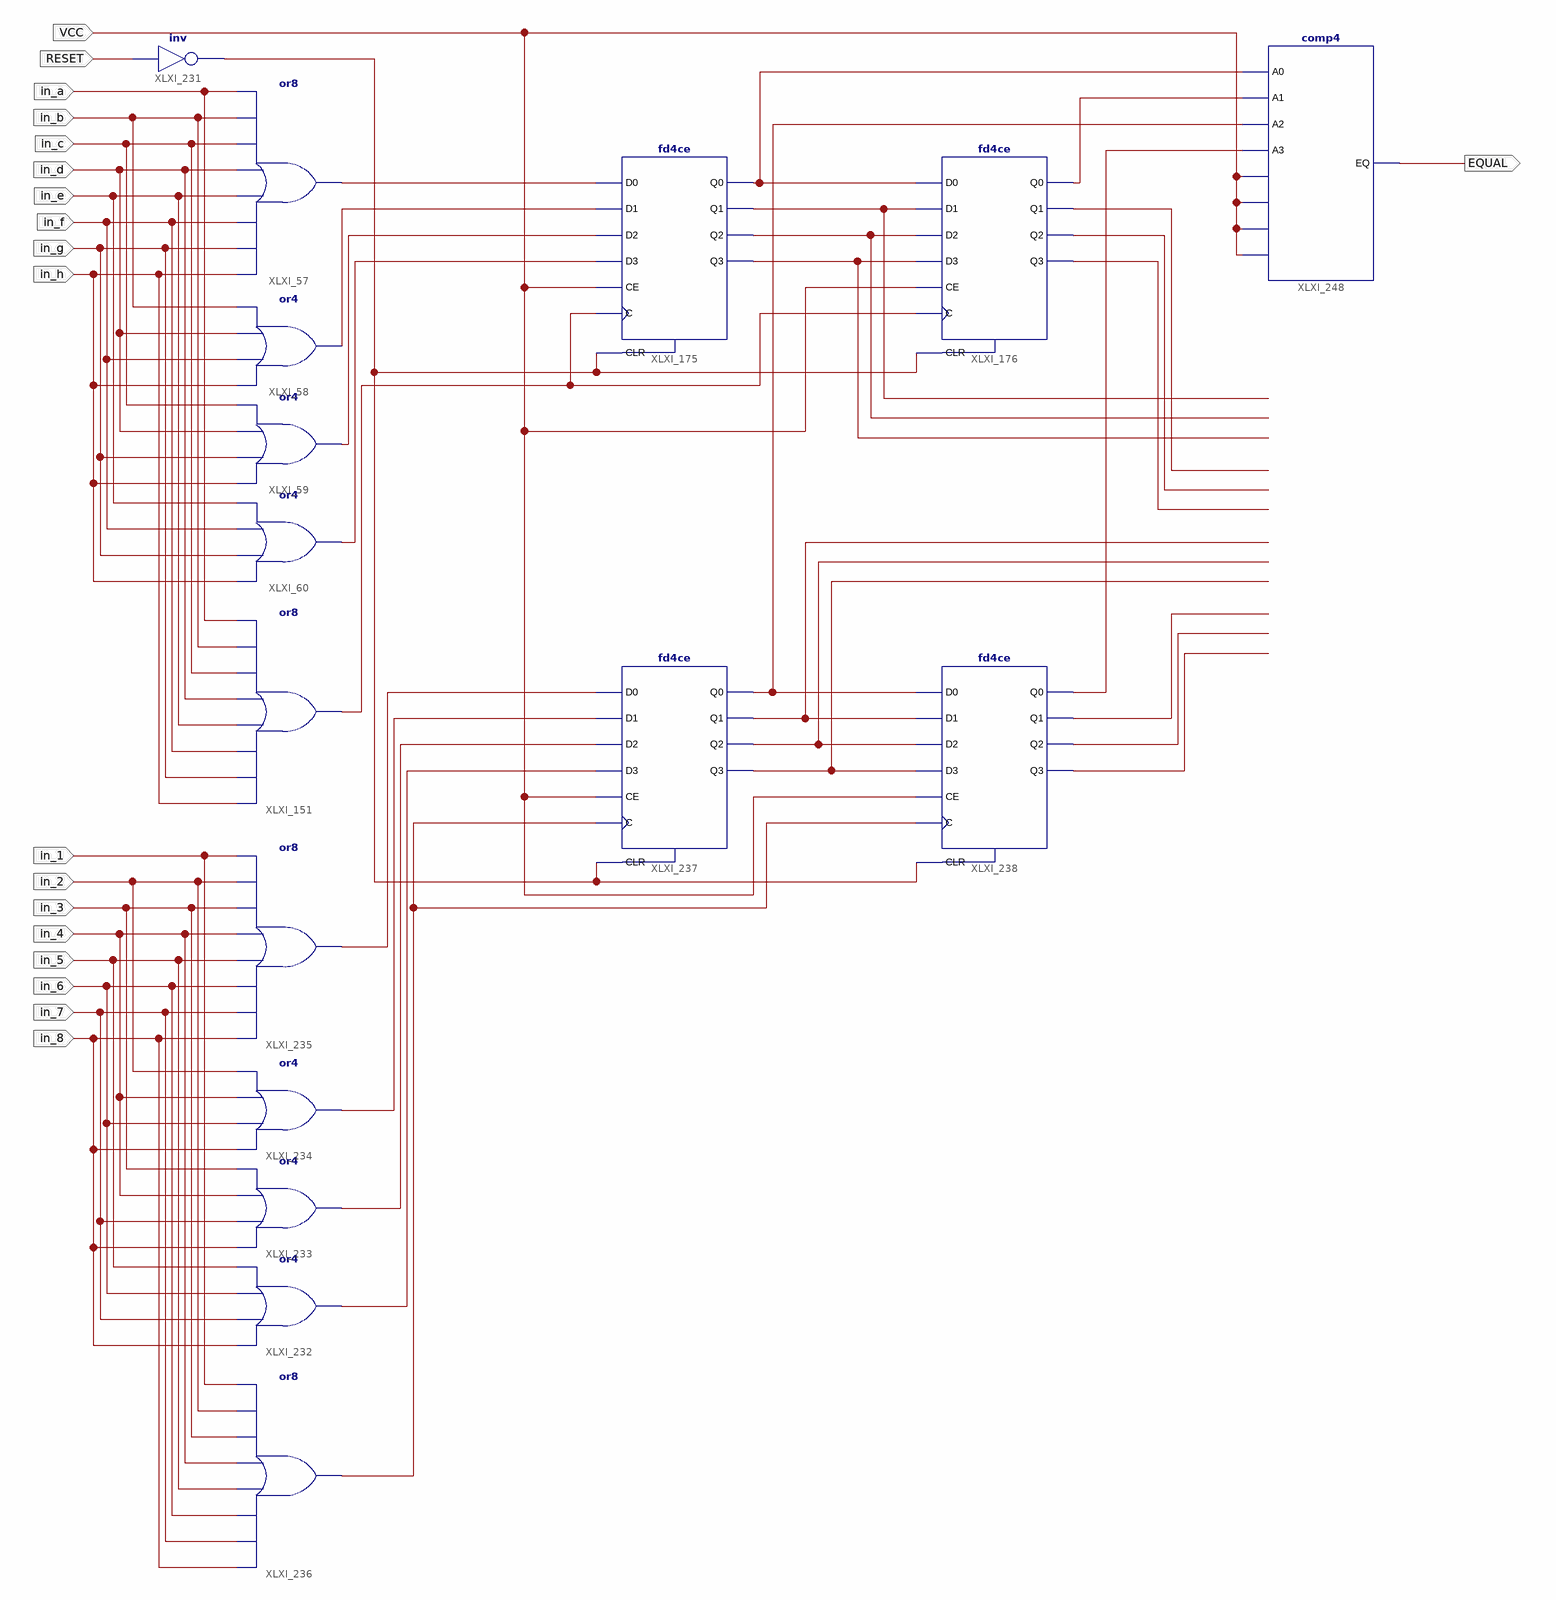
[diagram p0: schematic sheet 1]
// Xilinx ISE schematic switch_input.sch (spartan6) as structural Verilog: 16 symbols, 19 ports
module switch_input (
  input  in_a,
  input  in_g,
  input  in_h,
  input  in_f,
  input  in_e,
  input  in_d,
  input  in_c,
  input  in_b,
  input  RESET,
  input  in_1,
  input  in_7,
  input  in_8,
  input  in_6,
  input  in_5,
  input  in_4,
  input  in_3,
  input  in_2,
  input  VCC,
  output EQUAL
);

  wire comp_1, comp_2, comp_3, comp_4, XLXN_352, XLXN_353, XLXN_354, XLXN_355, XLXN_360, XLXN_511, XLXN_519,
       XLXN_521, XLXN_522, XLXN_523, XLXN_526, XLXN_539, XLXN_540, XLXN_542, XLXN_543, XLXN_544, XLXN_545,
       XLXN_546, XLXN_547, XLXN_548, XLXN_550, XLXN_552, XLXN_554;

  or XLXI_60 (XLXN_355, in_h, in_g, in_f, in_e);
  or XLXI_59 (XLXN_354, in_h, in_g, in_d, in_c);
  or XLXI_58 (XLXN_353, in_h, in_f, in_d, in_b);
  or XLXI_57 (XLXN_352, in_h, in_g, in_f, in_e, in_d, in_c, in_b, in_a);
  or XLXI_151 (XLXN_360, in_h, in_g, in_f, in_e, in_d, in_c, in_b, in_a);
  fd4ce XLXI_175 (
    .C(XLXN_360), .CE(VCC), .CLR(XLXN_519), .D0(XLXN_352), .D1(XLXN_353), .D2(XLXN_354), .D3(XLXN_355),
    .Q0(comp_1), .Q1(XLXN_543), .Q2(XLXN_544), .Q3(XLXN_545));
  fd4ce XLXI_176 (
    .C(XLXN_360), .CE(VCC), .CLR(XLXN_519), .D0(comp_1), .D1(XLXN_543), .D2(XLXN_544), .D3(XLXN_545),
    .Q0(comp_2), .Q1(XLXN_539), .Q2(XLXN_540), .Q3(XLXN_542));
  not XLXI_231 (XLXN_519, RESET);
  or XLXI_232 (XLXN_523, in_8, in_7, in_6, in_5);
  or XLXI_233 (XLXN_522, in_8, in_7, in_4, in_3);
  or XLXI_234 (XLXN_521, in_8, in_6, in_4, in_2);
  or XLXI_235 (XLXN_511, in_8, in_7, in_6, in_5, in_4, in_3, in_2, in_1);
  or XLXI_236 (XLXN_526, in_8, in_7, in_6, in_5, in_4, in_3, in_2, in_1);
  fd4ce XLXI_238 (
    .C(XLXN_526), .CE(VCC), .CLR(XLXN_519), .D0(comp_3), .D1(XLXN_546), .D2(XLXN_547), .D3(XLXN_548),
    .Q0(comp_4), .Q1(XLXN_550), .Q2(XLXN_552), .Q3(XLXN_554));
  fd4ce XLXI_237 (
    .C(XLXN_526), .CE(VCC), .CLR(XLXN_519), .D0(XLXN_511), .D1(XLXN_521), .D2(XLXN_522), .D3(XLXN_523),
    .Q0(comp_3), .Q1(XLXN_546), .Q2(XLXN_547), .Q3(XLXN_548));
  comp4 XLXI_248 (
    .A0(comp_1), .A1(comp_2), .A2(comp_3), .A3(comp_4), .B0(VCC), .B1(VCC), .B2(VCC), .B3(VCC), .EQ(EQUAL));
endmodule
